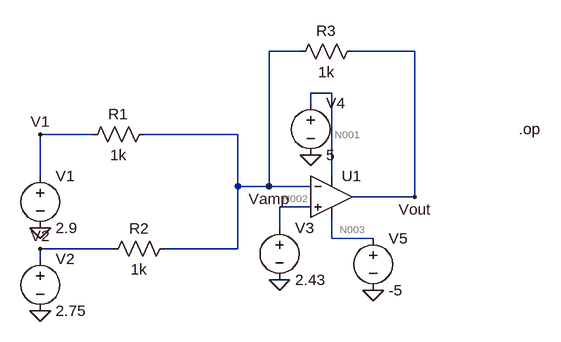
[diagram p0: schematic Summing_amplifier_schematic.asc]
Summing_amplifier_schematic.asc, the LTspice schematic file:
Version 4.1
SHEET 1 880 680
WIRE 448 -96 400 -96
WIRE 624 -96 528 -96
WIRE 496 -32 464 -32
WIRE 464 -16 464 -32
WIRE 128 32 48 32
WIRE 352 32 208 32
WIRE 48 96 48 32
WIRE 496 96 496 -32
WIRE 352 112 352 32
WIRE 400 112 400 -96
WIRE 400 112 352 112
WIRE 464 112 400 112
WIRE 624 128 624 -96
WIRE 624 128 528 128
WIRE 464 144 416 144
WIRE 416 176 416 144
WIRE 496 192 496 160
WIRE 560 192 496 192
WIRE 160 208 48 208
WIRE 352 208 352 112
WIRE 352 208 240 208
WIRE 48 224 48 208
FLAG 48 176 0
FLAG 48 304 0
FLAG 416 256 0
FLAG 464 64 0
FLAG 560 272 0
FLAG 624 128 Vout
FLAG 48 32 V1
FLAG 48 208 V2
FLAG 400 112 Vamp
SYMBOL voltage 48 80 R0
WINDOW 123 0 0 Left 0
WINDOW 39 0 0 Left 0
SYMATTR InstName V1
SYMATTR Value 2.9
SYMBOL res 224 16 R90
WINDOW 0 0 56 VBottom 2
WINDOW 3 32 56 VTop 2
SYMATTR InstName R1
SYMATTR Value 1k
SYMBOL voltage 48 208 R0
WINDOW 123 0 0 Left 0
WINDOW 39 0 0 Left 0
SYMATTR InstName V2
SYMATTR Value 2.75
SYMBOL res 256 192 R90
WINDOW 0 0 56 VBottom 2
WINDOW 3 32 56 VTop 2
SYMATTR InstName R2
SYMATTR Value 1k
SYMBOL OpAmps\\UniversalOpAmp2 496 128 R0
SYMATTR InstName U1
SYMBOL voltage 416 160 R0
WINDOW 123 0 0 Left 0
WINDOW 39 0 0 Left 0
SYMATTR InstName V3
SYMATTR Value 2.43
SYMBOL voltage 464 -32 R0
WINDOW 123 0 0 Left 0
WINDOW 39 0 0 Left 0
SYMATTR InstName V4
SYMATTR Value 5
SYMBOL voltage 560 176 R0
WINDOW 123 0 0 Left 0
WINDOW 39 0 0 Left 0
SYMATTR InstName V5
SYMATTR Value -5
SYMBOL res 544 -112 R90
WINDOW 0 0 56 VBottom 2
WINDOW 3 32 56 VTop 2
SYMATTR InstName R3
SYMATTR Value 1k
TEXT 784 24 Left 2 !.op

The netlist it stands for:
* Summing_amplifier_schematic.asc
V1 V1 0 2.9
R1 Vamp V1 1k
V2 V2 0 2.75
R2 Vamp V2 1k
X§U1 N002 Vamp N001 N003 Vout level2 Avol=1Meg GBW=10Meg Slew=10Meg Ilimit=25m Rail=0 Vos=0 En=0 Enk=0 In=0 Ink=0 Rin=500Meg  ; pins In+ In- V+ V- OUT
V3 N002 0 2.43
V4 N001 0 5
V5 N003 0 -5
R3 Vout Vamp 1k
.op
.lib UniversalOpAmp2.lib
.backanno
.end

* Results of the author's LTspice run, read from the files saved beside the schematic
* Operating Point:
*   V(vamp) = 2.43 V
*   V(n002) = 2.43 V
*   V(n001) = 5 V
*   V(vout) = 1.64 V
*   V(v1) = 2.9 V
*   V(v2) = 2.75 V
*   V(n003) = -5 V
*   I(V1) = -470 µA
*   I(V2) = -320 µA
*   I(V4) = -220.7 µA
*   I(R2) = -320 µA
*   I(V5) = 1.011 mA
*   I(R3) = -790 µA
*   I(R1) = -470 µA
*   I(V3) = -4.86 nA
*   Ix(u1:1) = 4.86 nA
*   Ix(u1:2) = 4.86 nA
*   Ix(u1:3) = 220.7 µA
*   Ix(u1:4) = -1.011 mA
*   Ix(u1:5) = 790 µA